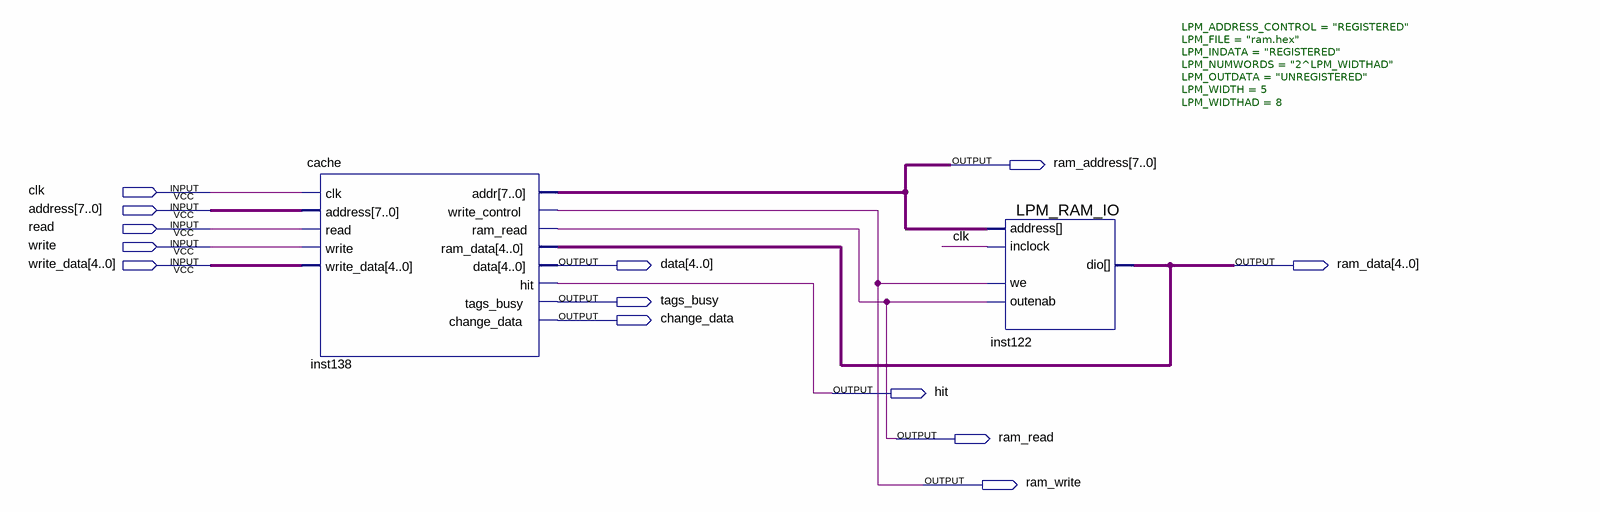
[diagram p0: schematic sheet]
// Quartus schematic lab6-7.bdf as structural Verilog: 2 symbols, 13 pins
module \lab6-7  (
  input  clk,
  input  [7:0] address,
  input  read,
  input  write,
  input  [4:0] write_data,
  output [7:0] ram_address,
  output [4:0] data,
  output [4:0] ram_data,
  output tags_busy,
  output change_data,
  output hit,
  output ram_read,
  output ram_write
);

  cache inst138 (
    .clk(clk), .address(address), .read(read), .write(write), .write_data(write_data), .addr(ram_address),
    .write_control(ram_write), .ram_read(ram_read), .ram_data(ram_data), .data(data), .hit(hit),
    .tags_busy(tags_busy), .change_data(change_data));
  LPM_RAM_IO #(.LPM_ADDRESS_CONTROL("REGISTERED"), .LPM_FILE("ram.hex"), .LPM_INDATA("REGISTERED"), .LPM_NUMWORDS("2^LPM_WIDTHAD"), .LPM_OUTDATA("UNREGISTERED"), .LPM_WIDTH(5), .LPM_WIDTHAD(8)) inst122 (
    .address(ram_address), .inclock(clk), .we(ram_write), .outenab(ram_read), .dio(ram_data));
endmodule
